# EAGLE design badge_0.0 (EAGLE 7.5.0)
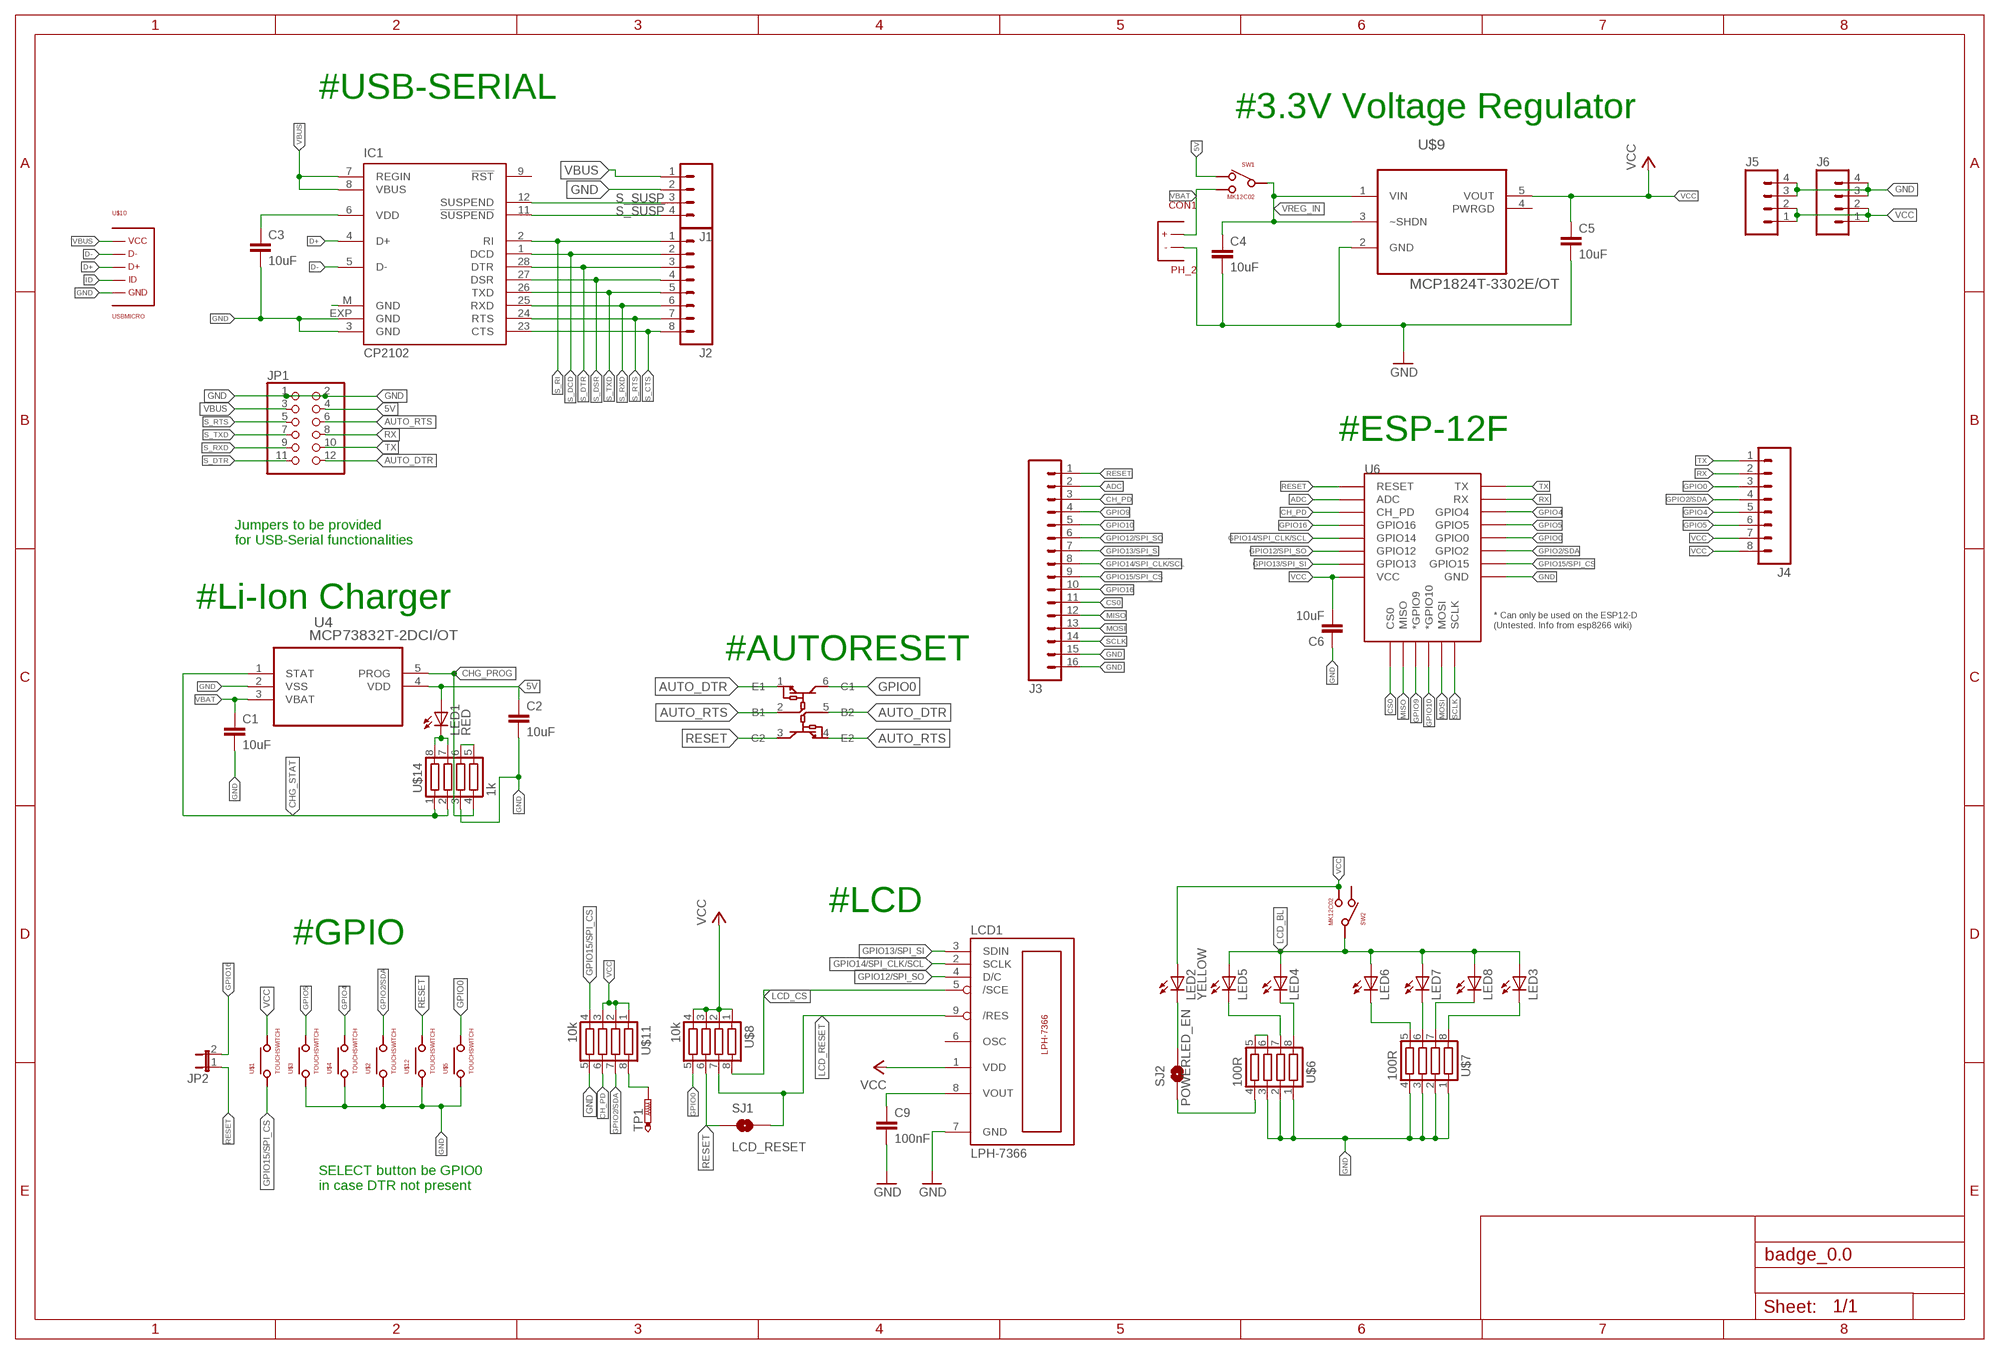
[diagram p0: schematic, sheet 1]

## Parts
C1  10uF  1UF-25V-10%(0805)"  [0805-CAP]
C2  10uF  1UF-25V-10%(0805)"  [0805-CAP]
C3  10uF  1UF-25V-10%(0805)"  [0805-CAP]
C4  10uF  1UF-25V-10%(0805)"  [0805-CAP]
C5  10uF  1UF-25V-10%(0805)"  [0805-CAP]
C6  10uF  1UF-25V-10%(0805)"  [0805-CAP]
C9  100nF  1UF-25V-10%(0805)"  [0805-CAP]
CON1  PH_2  [PH_2]
IC1  CP2102  [MLP28]
J1  M04PTH  [1X04]
J2  M08SILK_FEMALE_PTH  [1X08]
J3  M16PTH  [1X16]
J4  M08  [1X08_ROUND]
J5  M04PTH  [1X04]
J6  M04PTH  [1X04]
JP1  PINHD-2X6  [2X06]
JP2  JUMPER-2SMD-NO  [SJ_2S-NO]
LCD1  LPH-7366  [LPH-7366]
LED1  RED  LEDSML0805  [SML0805]
LED2  YELLOW  LEDSML0805  [SML0805]
LED3  LEDSML0805  [SML0805]
LED4  LEDSML0805  [SML0805]
LED5  LEDSML0805  [SML0805]
LED6  LEDSML0805  [SML0805]
LED7  LEDSML0805  [SML0805]
LED8  LEDSML0805  [SML0805]
SJ1  LCD_RESET  SOLDERJUMPERTRACE  [SJ_2S-TRACE]
SJ2  POWERLED_EN  SOLDERJUMPERTRACE  [SJ_2S-TRACE]
SW1  MK12C02  [MK12C02]
SW2  MK12C02  [MK12C02]
TP1  PTR1B1,27  [B1,27]
U4  MCP73832T-2DCI/OT  [SOT95P300X145-5N]
U6  ESP12ESMD  [ESP12E-SMD]
U$1  TOUCHSWITCH  [EVQQWN03W]
U$2  TOUCHSWITCH  [EVQQWN03W]
U$3  TOUCHSWITCH  [EVQQWN03W]
U$4  TOUCHSWITCH  [EVQQWN03W]
U$5  TOUCHSWITCH  [EVQQWN03W]
U$6  100R  RES_ARR  [YC164]
U$7  100R  RES_ARR  [YC164]
U$8  10k  RES_ARR  [YC164]
U$9  MCP1824T-3302E/OT  [SOT95P270X145-5N]
U$10  USBMICRO  [USBMICRO]
U$11  10k  RES_ARR  [YC164]
U$12  TOUCHSWITCH  [EVQQWN03W]
U$13  PEMH9,115  [SOT666]
U$14  1k  RES_ARR  [YC164]

## Nets
5V: C2.1 JP1.4 LED1.A SW1.P$2 U4.4(VDD)
ADC: J3.2 U6.ADC
AUTO_DTR: JP1.12 U$13.1(E1) U$13.5(B2)
AUTO_RTS: JP1.6 U$13.2(B1) U$13.4(E2)
CH_PD: J3.3 U6.CH_PD U$11.6
CHG_PROG: U4.5(PROG) U$14.4
CHG_STAT: U4.1(STAT) U$14.1 U$14.2
CS0: J3.11 U6.CS0
D+: IC1.4(D+) U$10.P$D+
D-: IC1.5(D-) U$10.P$D-
GND: C1.2 C2.2 C3.2 C4.2 C5.2 C6.1 C9.2 CON1.P$1 IC1.3(GND) IC1.EXP(GND) J1.2 J3.15 J3.16 J5.3 J5.4 J6.3 J6.4 JP1.1 JP1.2 LCD1.7(GND) U4.2(VSS) U6.GND U$2.P$1 U$2.P$4 U$3.P$1 U$3.P$4 U$4.P$1 U$4.P$4 U$5.P$1 U$5.P$4 U$6.1 U$6.2 U$6.3 U$7.1 U$7.2 U$7.3 U$7.4 U$9.2(GND) U$10.P$GND U$11.5 U$12.P$1 U$12.P$4 U$14.3
GPIO0: J4.3 U6.GPIO0 U$5.P$2 U$5.P$3 U$8.5 U$13.6(C1)
GPIO2/SDA: J4.4 U6.GPIO2 U$2.P$2 U$2.P$3 U$11.7
GPIO4: J4.5 U6.GPIO4 U$4.P$2 U$4.P$3
GPIO5: J4.6 U6.GPIO5 U$3.P$2 U$3.P$3
GPIO9: J3.4 U6.GPIO9(*GPIO9)
GPIO10: J3.5 U6.GPIO10(*GPIO10)
GPIO12/SPI_SO: J3.6 LCD1.4(D/C) U6.GPIO12
GPIO13/SPI_SI: J3.7 LCD1.3(SDIN) U6.GPIO13
GPIO14/SPI_CLK/SCL: J3.8 LCD1.2(SCLK) U6.GPIO14
GPIO15/SPI_CS: J3.9 U6.GPIO15 U$1.P$1 U$1.P$4 U$11.4
GPIO16: J3.10 JP2.2 U6.GPIO16
ID: U$10.P$ID
LCD_BL: LED3.A LED4.A LED5.A LED6.A LED7.A LED8.A SW2.P$1
LCD_CS: LCD1.5(/SCE) U$8.8
LCD_RESET: LCD1.9(/RES) SJ1.2 U$8.7
MISO: J3.12 U6.MISO
MOSI: J3.13 U6.MOSI
N$1: LED1.C U$14.7 U$14.8
N$2: U$14.5 U$14.6
N$3: TP1.TP U$11.8
N$5: IC1.M(GND)
N$7: LED7.C U$7.6
N$8: LED8.C U$7.7
N$9: C9.1 LCD1.8(VOUT)
N$11: U$6.5 U$6.6
N$12: LED4.C U$6.8
N$13: LED5.C U$6.7
N$14: LED3.C U$7.8
N$15: SJ2.1 U$6.4
N$16: LED2.C SJ2.2
N$20: C3.1 IC1.6(VDD)
N$22: LED6.C U$7.5
RESET: J3.1 JP2.1 SJ1.1 U6.RESET U$8.6 U$12.P$2 U$12.P$3 U$13.3(C2)
RX: J4.2 JP1.8 U6.RXD0(RX)
S_!SUSP: IC1.11(!SUSPEND) J1.4
S_CTS: IC1.23(CTS) J2.8
S_DCD: IC1.1(DCD) J2.2
S_DSR: IC1.27(DSR) J2.4
S_DTR: IC1.28(DTR) J2.3 JP1.11
S_RI: IC1.2(RI) J2.1
S_RTS: IC1.24(RTS) J2.7 JP1.5
S_RXD: IC1.25(RXD) J2.6 JP1.9
S_SUSP: IC1.12(SUSPEND) J1.3
S_TXD: IC1.26(TXD) J2.5 JP1.7
SCLK: J3.14 U6.SCLK
TX: J4.1 JP1.10 U6.TXD0(TX)
VBAT: C1.1 CON1.P$2 SW1.P$3 U4.3(VBAT)
VBUS: IC1.7(REGIN) IC1.8(VBUS) J1.1 JP1.3 U$10.P$VCC
VCC: C5.1 C6.2 J4.7 J4.8 J5.1 J5.2 J6.1 J6.2 LCD1.1(VDD) LED2.A SW2.P$3 U6.VCC U$1.P$2 U$1.P$3 U$8.1 U$8.2 U$8.3 U$8.4 U$9.5(VOUT) U$11.1 U$11.2 U$11.3
VREG_IN: C4.1 SW1.P$1 U$9.1(VIN) U$9.3(~SHDN)
Unconnected: IC1.9(!RST) LCD1.6(OSC) SW2.P$2 U$9.4(PWRGD)

## Notes on the sheet
- #USB-SERIAL
- #3.3V Voltage Regulator
- #ESP-12F
- Jumpers to be provided
  for USB-Serial functionalities
- #Li-Ion Charger
- #AUTORESET
- #LCD
- #GPIO
- SELECT button be GPIO0
  in case DTR not present

## Library data of the parts
C1-C6 C9 = SparkFun-Capacitors:1UF-25V-10%(0805): CAP-08064
CON1 = badge:PH_2
IC1 = silabs:CP210*: Single-Chip USB to UART Bridge Source: www.silabs.com .. CP2101.pdf / cp2102.pdf; MF: FARNELL; MPN: CP2102-GM; OC_FARNELL: 9282130; OC_NEWARK: 30K5635
J1 J5 J6 = SparkFun-Connectors:M04: Header 4 Standard 4-pin 0.1" header. Use with straight break away headers (SKU : PRT-00116), right angle break away headers (PRT-00553), swiss pins (PRT-00743), machine pins (PRT-00117), and female headers (PRT-00115). Molex polarized connector foot print use with SKU : PRT-08231 with associated crimp pins and housings. 1MM SMD Version SKU: PRT-10208; PROD_ID: CONN-09696
J2 = SparkFun-Connectors:M08: Header 8 Standard 8-pin 0.1" header. Use with straight break away headers (SKU : PRT-00116), right angle break away headers (PRT-00553), swiss pins (PRT-00743), machine pins (PRT-00117), and female headers (PRT-00115).; PROD_ID: CONN-08438
J3 = SparkFun-Connectors:M16: 1x16 .1" header
J4 = SparkFun-Connectors:M08: Header 8 Standard 8-pin 0.1" header. Use with straight break away headers (SKU : PRT-00116), right angle break away headers (PRT-00553), swiss pins (PRT-00743), machine pins (PRT-00117), and female headers (PRT-00115).; PROD_ID: CONN-08437
JP1 = pinhead:PINHD-2X6: PIN HEADER
JP2 = SparkFun-Retired:JUMPER-2: Jumper Basic 0.1" spaced jumper. Use with breakaway headers.
LCD1 = gm2:LPH-7366
LED1-LED8 = led:LED: LED OSRAM: - CHIPLED LG R971, LG N971, LY N971, LG Q971, LY Q971, LO R971, LY R971 LH N974, LH R974 LS Q976, LO Q976, LY Q976 LO Q996 - Hyper CHIPLED LW Q18S LB Q993, LB Q99A, LB R99A - SideLED LS A670, LO A670, LY A670, LG A670, LP A670 LB A673, LV A673, LT A673, LW A673 LH A674 LY A675 LS A676, LA A676, LO A676, LY A676, LW A676 LS A679, LY A679, LG A679 - Hyper Micro SIDELED® LS Y876, LA Y876, LO Y876, LY Y876 LT Y87S - SmartLED LW L88C, LW L88S LB L89C, LB L89S, LG L890 LS L89K, LO L89K, LY L89K LS L896, LA L896, LO L896, LY L896 - TOPLED LS T670, LO T670, LY T670, LG T670, LP T670 LSG T670, LSP T670, LSY T670, LOP T670, LYG T670 LG T671, LOG T671, LSG T671 LB T673, LV T673, LT T673, LW T673 LH T674 LS T676, LA T676, LO T676, LY T676, LB T676, LH T676, LSB T676, LW T676 LB T67C, LV T67C, LT T67C, LS T67K, LO T67K, LY T67K, LW E67C LS E67B, LA E67B, LO E67B, LY E67B, LB E67C, LV E67C, LT E67C LW T67C LS T679, LY T679, LG T679 LS T770, LO T770, LY T770, LG T770, LP T770 LB T773, LV T773, LT T773, LW T773 LH T774 LS E675, LA E675, LY E675, LS T675 LS T776, LA T776, LO T776, LY T776, LB T776 LHGB T686 LT T68C, LB T68C - Hyper Mini TOPLED® LB M676 - Mini TOPLED Santana® LG M470 LS M47K, LO M47K, LY M47K Source: http://www.osram.convergy.de LUXEON: - LUMILED® LXK2-PW12-R00, LXK2-PW12-S00, LXK2-PW14-U00, LXK2-PW14-V00 LXK2-PM12-R00, LXK2-PM12-S00, LXK2-PM14-U00 LXK2-PE12-Q00, LXK2-PE12-R00, LXK2-PE12-S00, LXK2-PE14-T00, LXK2-PE14-U00 LXK2-PB12-K00, LXK2-PB12-L00, LXK2-PB12-M00, LXK2-PB14-N00, LXK2-PB14-P00, LXK2-PB14-Q00 LXK2-PR12-L00, LXK2-PR12-M00, LXK2-PR14-Q00, LXK2-PR14-R00 LXK2-PD12-Q00, LXK2-PD12-R00, LXK2-PD12-S00 LXK2-PH12-R00, LXK2-PH12-S00 LXK2-PL12-P00, LXK2-PL12-Q00, LXK2-PL12-R00 Source: www.luxeon.com KINGBRIGHT: KA-3528ASYC Source: www.kingbright.com
SJ1 SJ2 = SparkFun-Retired:SOLDERJUMPER: Solder Jumper Standard SMD solder jumper. Used to automate production. Two varients : Normally Open and Normally Closed are the same, but have different paste layers. NC will have a large amount of paste and should jumper during reflow.
SW1 SW2 = badge:MK12C02
TP1 = testpad:PTR1: TEST PIN
U4 = Microchip_By_element14_Batch_1:MCP73832T-2DCI/OT: IC, BATT CHARGER, Li-Ion Li-Polymer, 500 mA; MPN: MCP73832T-2DCI/OT; OC_FARNELL: 1834892; OC_NEWARK: 84R5198; PACKAGE: SOT23-5; SUPPLIER: Microchip
U6 = esp8266modules:ESP12E: ESP12E Module
U$1-U$5 U$12 = badge:TOUCHSWITCH
U$6-U$8 U$11 U$14 = Simplex-rlc:RES_ARR: resistor chip array yageo YC164 series (8pin/4R)
U$9 = Microchip_By_element14_Batch_1:MCP1824T-3302E/OT: 300 mA, Low Voltage, Low Quiescent Current LDO Regulator; MPN: MCP1824T-3302E/OT; OC_FARNELL: 1578387; OC_NEWARK: 40M0704; PACKAGE: SOT23-5; SUPPLIER: Microchip
U$10 = badge:USBMICRO
U$13 = LYS_special:PEMH9,115

## Board
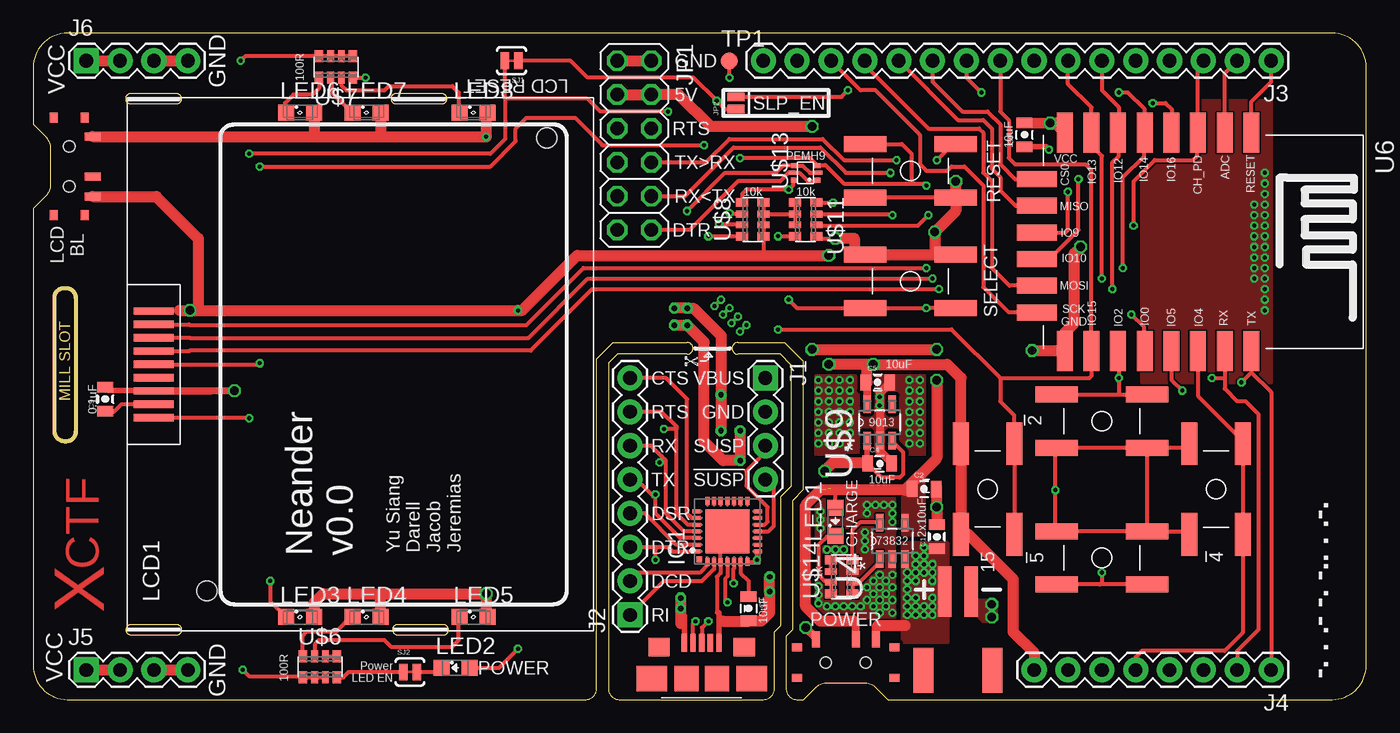
[diagram p1: board, top side]
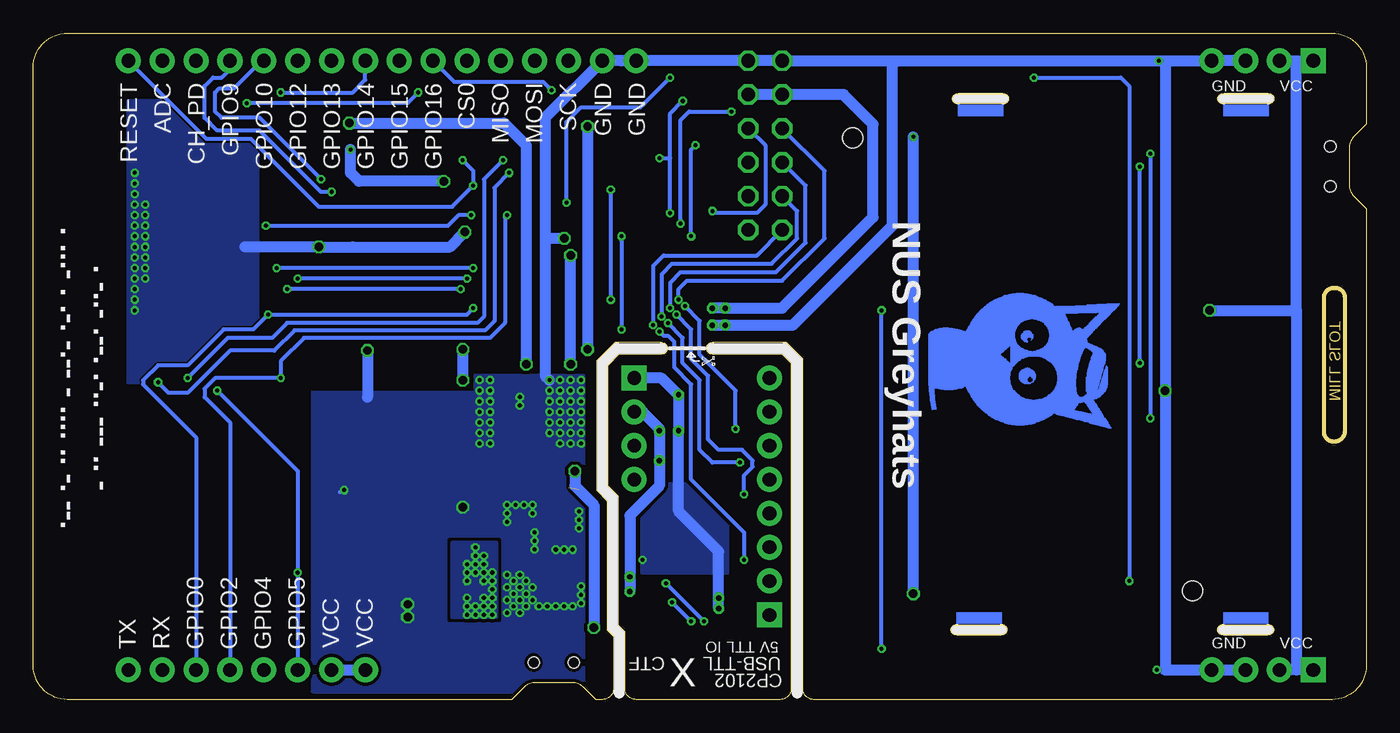
[diagram p2: board, bottom side, seen from below]

Size 100 x 50 mm. Coordinates in mm from the lower left corner, seen from the top.
Outline: 6.94,5.22 arc-90 7.33,5.62 10.75,5.62 arc-90 11.14,5.22 arc-90 10.78,4.86 7.35,4.86
Outline: 6.94,5.24 arc90 7.32,4.86 7.33,4.86
Outline: 26.94,5.22 arc-90 27.34,5.62 30.75,5.62 arc-90 31.15,5.22 arc-90 30.78,4.86 27.35,4.86
Outline: 26.94,5.24 arc90 27.32,4.86 27.34,4.86
Outline: 11.13,45.1 arc-90 10.73,44.7 7.32,44.7 arc-90 6.92,45.1 arc-90 7.29,45.47 10.72,45.47
Outline: 11.13,45.09 arc90 10.75,45.47 10.73,45.47
Outline: 31.04,45.1 arc-90 30.64,44.7 27.23,44.7 arc-90 26.83,45.1 arc-90 27.19,45.47 30.62,45.47
Outline: 31.04,45.09 arc90 30.66,45.47 30.64,45.47
Outline: 64.14,0 97.46,0 arc90 100,2.54 100,47.46 arc90 97.46,50 2.54,50 arc90 0,47.46 0,43.18 0.9,42.28 arc-45 1.27,41.38 1.27,38.63 arc-45 0.9,37.73 0,36.83 0,2.54 arc90 2.54,0 41.45,0 arc90 42.27,0.81 42.27,25.56 43.5,26.79 49.05,26.79 arc-180 49.05,25.92 43.81,25.92 43.14,25.24 43.14,0.81 arc90 43.95,0 54.79,0 arc90 55.6,0.81 55.6,5.08 56.08,5.56 56.08,15.24 56.87,16.03 56.87,25.08 56.04,25.92 52.86,25.92 arc-180 52.86,26.79 56.36,26.79 57.74,25.4 57.74,15.72 56.95,14.92 56.95,5.24 56.48,4.76 56.48,0.81 arc90 57.29,0 57.78,0 58.68,0.9 arc-45 59.58,1.27 62.34,1.27 arc-45 63.24,0.9 64.14,0
Outline: 1.59,30.16 arc-90 2.3,30.88 2.46,30.88 arc-90 3.17,30.16 3.17,20.08 arc-90 2.46,19.37 2.38,19.37 arc-90 1.59,20.16 1.59,30.16
Copper layers (1*16): Top 0.035mm / dielectric 1.5mm / Bottom 0.035mm
Design rules "dirt_cheap_dirty_boards.v1": minimum track width 5mil, minimum drill 12mil, track to track 5mil, track to pad 5mil, pad to pad 5mil, via to via 5mil, smd to smd 0mil, copper to edge 10mil, drill to drill 10mil, minimum pad ring 10mil, minimum via ring 6mil, stop-mask expansion 2mil, vias tented up to drill 25mil, thermal gap 10mil

### Footprints (pad centres in the part's own frame; a part is rotated, then mirrored left to right if it is on the bottom)
0805-CAP = smd 0.8 x 1.2: 1 -0.9,0; 2 0.9,0
PH_2 = smd 1 x 3.8: P$1 -1,0; P$2 1,0 | smd 1.5 x 3.4: P$3 -2.6,5.9; P$4 2.6,5.9
MLP28 = smd 0.6 x 0.3: 1 -2.3,1.5; 2 -2.3,1; 3 -2.3,0.5; 4 -2.3,0; 5 -2.3,-0.5; 6 -2.3,-1; 7 -2.3,-1.5; 15 2.3,-1.5; 16 2.3,-1; 17 2.3,-0.5; 18 2.3,0; 19 2.3,0.5; 20 2.3,1; 21 2.3,1.5 | smd 0.3 x 0.6: 8 -1.5,-2.3; 9 -1,-2.3; 10 -0.5,-2.3; 11 0,-2.3; 12 0.5,-2.3; 13 1,-2.3; 14 1.5,-2.3; 22 1.5,2.3; 23 1,2.3; 24 0.5,2.3; 25 0,2.3; 26 -0.5,2.3; 27 -1,2.3; 28 -1.5,2.3 | smd 3.3 x 3.3: EXP 0,0 | smd 0.435 x 0.435: M -2.103,2.103
1X04 = drill 1.016 pad 1.88 square: 1 0,0 | drill 1.016 pad 1.88: 2 2.54,0; 3 5.08,0; 4 7.62,0
1X08 = drill 1.016 pad 1.88 square: 1 0,0 | drill 1.016 pad 1.88: 2 2.54,0; 3 5.08,0; 4 7.62,0; 5 10.16,0; 6 12.7,0; 7 15.24,0; 8 17.78,0
1X16 = drill 1.016 pad 1.88: 1 0,0; 2 2.54,0; 3 5.08,0; 4 7.62,0; 5 10.16,0; 6 12.7,0; 7 15.24,0; 8 17.78,0; 9 20.32,0; 10 22.86,0; 11 25.4,0; 12 27.94,0; 13 30.48,0; 14 33.02,0; 15 35.56,0; 16 38.1,0
1X08_ROUND = drill 1.016 pad 1.88: 1 0,0; 2 2.54,0; 3 5.08,0; 4 7.62,0; 5 10.16,0; 6 12.7,0; 7 15.24,0; 8 17.78,0
2X06 = drill 1.016 octagon: 1 -6.35,-1.27; 2 -6.35,1.27; 3 -3.81,-1.27; 4 -3.81,1.27; 5 -1.27,-1.27; 6 -1.27,1.27; 7 1.27,-1.27; 8 1.27,1.27; 9 3.81,-1.27; 10 3.81,1.27; 11 6.35,-1.27; 12 6.35,1.27
SJ_2S-NO = smd 0.635 x 1.27: 1 -0.45,0; 2 0.45,0
LPH-7366 = smd 0.55 x 3: 1 4,17; 2 3,17; 3 2,17; 4 1,17; 5 0,17; 6 -1,17; 7 -2,17; 8 -3,17; 9 -4,17 | hole 1.5: -17,13; 17,-12.5
SML0805 = smd 1.2 x 1.2: A 1.05,0; C -1.05,0
SJ_2S-TRACE = smd 0.635 x 1.27: 1 -0.508,0; 2 0.508,0
MK12C02 = smd 0.6 x 1.2: P$1 -2.25,1.75; P$2 0.75,1.75; P$3 2.25,1.75 | smd 0.75 x 0.6: P$4 -3.65,1.15; P$5 -3.65,-1.15; P$6 3.65,1.15; P$7 3.65,-1.15 | hole 0.85: -1.5,0; 1.5,0
B1,27 = smd 1.27 x 1.27: TP 0,0
SOT95P300X145-5N = smd 1.321 x 0.559: 1 -1.372,0.94; 2 -1.372,0; 3 -1.372,-0.94; 4 1.372,-0.94; 5 1.372,0.94
ESP12E-SMD = smd 3 x 1.2: ADC -8.3,3.8; CH_PD -8.3,1.8; GND 8.1,-8.2; GPIO0 8.1,-2.2; GPIO2 8.1,-4.2; GPIO4 8.1,1.8; GPIO5 8.1,-0.2; GPIO12 -8.3,-4.2; GPIO13 -8.3,-6.2; GPIO14 -8.3,-2.2; GPIO15 8.1,-6.2; GPIO16 -8.3,-0.2; RESET -8.3,5.8; RXD0 8.1,3.8; TXD0 8.1,5.8; VCC -8.3,-8.2 | smd 1.2 x 3: CS0 -4.8,-10.3; GPIO9 -0.8,-10.3; GPIO10 1.2,-10.3; MISO -2.8,-10.3; MOSI 3.2,-10.3; SCLK 5.2,-10.3
EVQQWN03W = smd 1.2 x 3.2: P$1 -2,3.4; P$2 2,3.4; P$3 2,-3.4; P$4 -2,-3.4
YC164 = smd 0.65 x 0.9: 1 -1.275,-0.8; 4 1.275,-0.8; 5 1.275,0.8; 8 -1.275,0.8 | smd 0.5 x 0.9: 2 -0.4,-0.8; 3 0.4,-0.8; 6 0.4,0.8; 7 -0.4,0.8
SOT95P270X145-5N = smd 1.321 x 0.559: 1 -1.372,0.94; 2 -1.372,0; 3 -1.372,-0.94; 4 1.372,-0.94; 5 1.372,0.94
USBMICRO = smd 1.6 x 1.4: P$6 -3.2,2.35; P$7 3.2,2.35 | smd 1.8 x 1.9: P$8 -1.15,0; P$9 1.15,0 | smd 2.3 x 1.9: P$10 -3.75,0; P$11 3.75,0 | smd 0.4 x 1.35: P$D+ 0,2.675; P$D- -0.65,2.675; P$GND 1.3,2.675; P$ID 0.65,2.675; P$VCC -1.3,2.675
SOT666 = smd 0.375 x 0.5: 1 -0.537,-0.85; 3 0.538,-0.85; 4 0.538,0.849; 6 -0.538,0.85 | smd 0.3 x 0.65: 2 0,-0.923; 5 0,0.925

### Placement (x,y rotation side)
C1  67.79,12.22 90 top
C2  66.83,15.8 0 top
C3  53.66,6.83 270 top
C4  63.5,17.7 0 top
C5  63.34,23.81 0 top
C6  74.37,42.39 90 top
C9  5.4,22.54 90 top
CON1  69.37,8.1 180 top
IC1  52.07,12.62 90 top
J1  54.93,24.13 270 top
J2  44.77,6.35 90 top
J3  92.87,47.94 180 top
J4  92.87,2.22 180 top
J5  3.97,2.22 0 top
J6  3.97,47.94 0 top
JP1  45.09,41.59 270 top
JP2  52.7,44.77 90 top
LCD1  26.04,25.16 90 top
LED1  60.17,13.34 90 top
LED2  31.67,2.38 0 top
LED3  20,6.19 0 top
LED4  25,6.19 0 top
LED5  33.02,6.19 0 top
LED6  20,44.05 0 top
LED7  25,44.05 0 top
LED8  33.02,44.05 0 top
SJ1  35.88,47.94 180 top
SJ2  28.26,2.06 0 top
SW1  60.96,2.78 0 top
SW2  2.7,40.01 270 top
TP1  52.23,47.94 0 top
U4  64.45,11.91 90 top
U6  85.59,34.25 270 top
U$1  71.6,15.8 180 top
U$2  80.17,20.88 90 top
U$3  80.17,10.63 270 top
U$4  88.74,15.79 0 top
U$5  65.8,31.4 270 top
U$6  21.51,2.46 0 top
U$7  22.7,47.47 180 top
U$8  53.98,36.04 90 top
U$9  63.5,20.8 90 top
U$10  50.14,1.59 0 top
U$11  57.94,36.04 270 top
U$12  65.8,39.69 90 top
U$13  57.94,39.53 90 top
U$14  60.64,9.21 90 top

### Tracks (layer width: path | path; a pad name or v marks a point on that pad's centre or on a via)
5V  (via drill 0.64)  (1 unrouted)
  Top 0.305: 59.85,15.88 60.17,15.56 LED1.A
  Top 0.61: SW1.P$2 61.71,5.76 61.59,5.87
  Top 0.813: v58.42,43.02 50.8,43.02 48.42,45.4 JP1.4 | v58.42,26.27 v67.79,26.27 | v67.79,23.97 67.79,18.1 65.41,15.72 59.05,15.72 57.94,14.61 57.94,6.99 59.05,5.87 61.59,5.87
  Bottom 0.813: v58.42,43.02 v58.42,26.27 | v67.79,26.27 v67.79,23.97
  pour Top (isolate 0.254, no thermals): 65.25,15.56 65.25,12.38 66.83,12.38 66.83,17.14
ADC
  Top 0.305: U6.ADC 89.39,47 J3.2
AUTO_DTR
  Top 0.305: U$13.1 58.7,38.89 58.1,38.89 57.47,39.53 U$13.5 56.67,39.53 56.04,38.89 52.86,38.89 49.21,35.24 JP1.12
AUTO_RTS  (via drill 0.3)
  Top 0.305: U$13.2 58.26,39.53 57.72,40.07 U$13.4 56.26,40.07 55.72,39.53 51.91,39.53 v49.05,36.67
  Bottom 0.305: JP1.6 45.09,41.59 45.09,37.15 45.72,36.51 48.9,36.51 v49.05,36.67
CH_PD  (via drill 0.3, 0.3 pad 0.3)
  Top 0.305: U$11.6 58.82,35.56 66.36,35.56 v67.15,36.35 | J3.3 87.39,47.54 U6.CH_PD 87.31,42.48 87.31,40.8 87,40.48 84.14,40.48 82.55,38.89 v82.55,35.56
  Bottom 0.305: v82.55,35.56 68.9,35.56 68.1,36.35 v67.15,36.35
CHG_PROG
  Top 0.305: U4.5 62.01,13.28 61.44,12.7 U$14.4
CHG_STAT
  Top 0.305: 63.5,10.79 63.51,10.78 U4.1 63.51,10.33 61.99,8.81 U$14.2 U$14.1
CS0
  Top 0.305: 75.29,39.33 U6.CS0 73.66,39.05 72.55,40.16 72.55,43.18 71.6,44.13 69.69,44.13 67.47,46.35 J3.11
D+  (via drill 0.3)
  Top 0.305: IC1.4 52.07,9.21 51.91,9.05 51.91,7.46 v52.07,7.3 | v50.64,5.87 50.16,5.4 50.16,4.29 U$10.P$D+
  Bottom 0.305: v52.07,7.3 v50.64,5.87
D-  (via drill 0.3)
  Top 0.305: U$10.P$D- 49.49,5.67 v49.69,5.87 | v52.55,8.73 52.55,9.84 52.57,9.87 IC1.5
  Bottom 0.305: v49.69,5.87 v52.55,8.73
GND  (via drill 0.3, 0.3 pad 0.41, 0.41 pad 0.81, 0.64)
  Top 0.305: U$7.1 U$7.2 U$7.3 U$7.4 15.88,48.27 v15.56,47.94 | C9.2 5.4,23.34 5.56,23.18 | 9.02,23.18 LCD1.7 | U$6.3 U$6.2 U$6.1 20.15,1.75 16.19,1.75 v15.72,2.22 | IC1.EXP 51.57,12.12 IC1.3 51.57,9.5 51.28,9.21 51.28,6.51 51.44,6.51 | 51.44,5.24 | U$3.P$1 U$2.P$4 | U$3.P$1 U$3.P$4 76.68,12.54 v76.68,15.72 76.68,18.86 76.69,18.88 76.68,18.89 76.52,18.89 | U$4.P$1 86.43,18.88 U$2.P$4 | U$3.P$1 86.5,12.63 U$4.P$4 | U$5.P$4 62.4,33.8 | U$2.P$4 U$2.P$1 | U$12.P$4 U$12.P$1 62.4,37.93 | U$5.P$1 69.11,33.5 67.63,33.5 | U$11.5 58.9,34.76 59.05,34.61 v60.17,34.61 | 61.44,34.77 61.59,34.61
  Top 0.406: U$10.P$GND 51.44,5.24 51.44,5.56 | 51.44,5.24 51.44,5.87 | 51.44,5.87 51.44,6.51 | 51.44,5.87 51.75,5.87 | 69.22,37.7 U$12.P$4 | C6.1 75.96,41.51 v76.2,41.27 | 9.02,23.18 5.66,23.18 C9.2
  Top 0.546: LCD1.7 13.32,23.16 v15.08,23.18
  Top 0.61: C5.2 64.22,23.73 63.5,23.02 v63.5,22.7 v63.5,22.07 U$9.2 63.5,18.65 64.4,17.75 C4.2
  Top 0.813: C2.2 67.79,15.95 v67.79,14.45 C1.2 | JP1.1 JP1.2 | v74.93,26.19 77.34,26.19 U6.GND 77.39,27.54 78.11,28.26 78.11,33.5 v78.58,33.97 | 67.63,33.5 v67.63,35.08 69.2,36.66 U$12.P$4 | U$5.P$4 U$5.P$1 | 61.59,33.5 61.59,34.61 v60.17,34.61 | 51.75,5.87 53.74,5.87 C3.2 53.89,5.87 54.61,5.87 55.24,6.51 v55.24,8.1 v55.24,9.21 | J5.3 J5.4 | J6.3 J6.4 | v53.02,20.16 v53.02,17.94 51.75,17.94 50.32,19.37 50.32,26.83 v49.05,28.1 v48.1,28.1 | CON1.P$1 70.37,6.71 70.33,7.14 | 69.22,37.7 v69.22,38.89
  Bottom 0.305: 55.56,47.62 55.88,47.94 | 55.56,47.78 55.4,47.94 | 15.08,2.22 v15.72,2.22 | v76.68,15.72 76.83,15.72 76.99,15.56
  Bottom 0.406: 76.2,34.13 76.04,33.97
  Bottom 0.813: 61.59,34.45 61.59,43.66 J3.15 55.88,47.94 55.4,47.94 J3.16 JP1.2 JP1.1 35.24,47.94 | 61.59,34.45 61.59,24.29 v61.28,23.97 | v67.63,35.08 68.74,33.97 76.04,33.97 v78.58,33.97 84.14,33.97 | J6.3 J6.4 15.08,47.94 | 35.24,47.94 v15.56,47.94 15.08,47.94 | 15.08,47.94 v15.08,23.18 15.08,2.22 J5.4 J5.3 | J1.2 54.29,21.59 53.02,20.32 v53.02,20.16 v53.02,17.94 53.02,16.03 55.24,13.81 v55.24,9.21 v55.24,8.1 | v49.05,28.1 v48.1,28.1 43.02,28.1 35.56,35.56 35.56,47.62 35.24,47.94 | v60.17,34.61 61.44,34.61 61.59,34.45 | v74.93,26.19 74.93,22.7 | v69.22,38.89 75.56,38.89 76.2,39.53 v76.2,41.27
  other vias: 59.69,23.97 60.48,23.97 59.69,23.18 60.48,23.18 61.28,23.18 61.28,22.38 60.48,22.38 59.69,22.38 59.69,21.59 60.48,21.59 61.28,21.59 61.28,20.8 60.48,20.8 59.69,20.8 59.69,20 60.48,20 61.28,20 60.48,19.21 59.69,19.21 65.72,23.97 65.72,23.18 65.72,22.38 65.72,21.59 65.72,20.8 65.72,20 65.72,19.21 64.45,13.34 71.91,7.14 64.45,13.97 64.45,14.61 63.82,14.61 63.18,14.61 62.55,13.97 62.55,14.61 59.05,14.13 59.05,13.49 59.05,12.86 62.39,12.54 62.39,11.91 62.39,11.27 59.53,11.25 60.8,11.25 60.17,11.25 64.45,9.37 63.5,9.37 64.45,8.41 63.98,8.89 63.5,8.41 63.02,8.89 62.55,8.41 63.02,7.94 63.98,7.94 64.45,7.46 63.5,7.46 63.98,6.99 64.45,6.51 62.55,7.46 63.02,6.99 63.5,6.51 62.07,6.99 60.8,6.99 60.17,6.99 59.53,6.99 58.9,7.22 58.9,8.49 61.44,6.99 58.9,7.86 58.9,23.97 58.9,23.18 58.9,22.38 58.9,21.59 58.9,20.8 58.9,20 58.9,19.21 66.52,19.21 66.52,20 66.52,20.8 66.52,21.59 66.52,22.38 66.52,23.18 66.52,23.97 71.91,6.19 92.39,39.53 92.39,38.73 92.39,37.94 91.6,37.15 92.39,37.15 91.6,36.35 92.39,36.35 91.6,35.56 92.39,35.56 91.6,34.77 92.39,34.77 91.6,33.97 92.39,33.97 91.6,33.18 92.39,33.18 91.6,32.38 92.39,32.38 91.6,31.59 92.39,31.59 92.39,30.8 92.39,30 92.39,29.21
  pour Top (isolate 0.254, no thermals): 58.74,18.41 58.74,24.29 66.83,24.29 66.83,18.41
  pour Bottom (isolate 0.254, rank 3, no thermals): 58.74,24.29 66.83,24.29 66.83,23.02 79.06,23.02 79.06,0.64 58.74,0.64
  pour Top (isolate 0.127, no thermals): 58.74,15.08 58.74,6.19 64.61,6.19 64.61,15.08
  pour Top (no thermals): 70.33,7.46 72.07,7.46 72.23,7.3 72.23,6.03 72.07,5.87 71.28,5.87 70.33,6.83
  pour Top: 92.87,44.93 92.87,23.81 83.19,23.81 83.19,44.93
  pour Bottom: 92.87,44.93 92.87,23.81 83.19,23.81 83.19,44.93
GPIO0  (via drill 0.3, 0.3 pad 0.3)
  Top 0.305: U6.GPIO0 83.34,26.19 83.34,27.94 v82.39,28.89 | v56.67,30 57.31,29.37 62.37,29.37 U$5.P$3 66.96,29.4 v66.99,29.37 67.02,29.4 U$5.P$2 | U$13.6 56.99,38.89 56.99,38.58 v56.67,38.26 53.5,38.26 53.18,37.94 U$8.5
  Bottom 0.305: v56.67,30 v56.67,38.26 | J4.3 87.79,19.68 91.76,23.65 91.76,23.97 90.65,25.08 88.42,25.08 85.72,27.78 83.5,27.78 v82.39,28.89 67.47,28.89 v66.99,29.37
GPIO2/SDA  (via drill 0.3 pad 0.3)
  Top 0.305: U6.GPIO2 81.44,26.04 v81.44,24.13 81.44,22.88 | U$11.7 64.37,36.44 v64.45,36.35 | 76.75,22.86 U$2.P$2 81.44,22.88 | 81.44,22.88 U$2.P$3 83.01,22.88
  Bottom 0.305: v64.45,36.35 64.61,36.2 64.61,28.26 65.72,27.15 79.69,27.15 81.44,25.4 v81.44,24.13 86.36,24.13 87.15,23.34 87.15,22.7 85.25,20.8 J4.4
GPIO4
  Top 0.305: U6.GPIO4 87.39,22.79 90.49,19.68 90.49,19.44 U$4.P$2 U$4.P$3 90.74,5.02 89.38,3.65 83.19,3.65 82.71,3.17 J4.5
GPIO5  (via drill 0.3)
  Top 0.305: U6.GPIO5 85.39,23.99 v86.2,23.18 | U$3.P$2 80.01,8.63 | 80.01,8.63 U$3.P$3 | v80.17,9.53 80.17,8.79 80.01,8.63
  Bottom 0.305: v86.2,23.18 80.17,17.14 v80.17,9.53 J4.6
GPIO9  (via drill 0.3)
  Top 0.305: U6.GPIO9 77.44,35.05 77.63,35.24 v77.63,38.1
  Bottom 0.305: v77.63,38.1 78.42,38.1 83.03,42.7 86.2,42.7 87.15,43.66 87.15,46.04 86.52,46.67 85.88,46.67 85.25,47.31 J3.4
GPIO10  (via drill 0.3)
  Top 0.305: U6.GPIO10 76.23,33.05 78.42,35.24 v78.42,39.05
  Bottom 0.305: J3.5 82.87,47.94 84.93,45.88 86.04,45.88 86.36,45.56 86.36,44.13 85.88,43.66 83.03,43.66 v78.42,39.05
GPIO12/SPI_SO  (via drill 0.3 pad 0.3)
  Top 0.305: LCD1.4 11.71,26.16 11.75,26.19 37.31,26.19 41.91,30.8 v67.94,30.8 | J3.6 80.17,45.72 81.44,44.45 81.44,42.6 | 81.44,42.6 U6.GPIO12 | v80.96,30.8 80.96,40.32 81.44,40.8 81.44,42.6
  Bottom 0.305: v67.94,30.8 v80.96,30.8
GPIO13/SPI_SI  (via drill 0.3 pad 0.3)
  Top 0.305: LCD1.3 11.73,27.16 11.75,27.15 37.15,27.15 41.59,31.59 v67.47,31.59 | J3.7 77.63,46.2 79.39,44.44 U6.GPIO13 79.38,42.54 79.38,41.59 80.17,40.8 v80.17,31.59
  Bottom 0.305: v67.47,31.59 v80.17,31.59
GPIO14/SPI_CLK/SCL  (via drill 0.3, 0.3 pad 0.3)
  Top 0.305: LCD1.2 11.69,28.16 11.75,28.1 36.99,28.1 41.27,32.38 v66.99,32.38 | v81.44,45.56 82.11,45.56 83.39,44.29 U6.GPIO14 83.34,42.51 83.34,40.8 81.76,39.21 v81.76,32.38
  Bottom 0.305: v81.44,45.56 76.04,45.56 75.09,46.51 J3.8 | v66.99,32.38 v81.76,32.38
GPIO15/SPI_CS  (via drill 0.3)
  Top 0.305: 72.55,24.13 79.22,24.13 79.39,24.3 U6.GPIO15 79.38,26.14 79.38,39.72 78.93,40.16 73.66,40.16 73.18,40.64 73.18,43.5 72.55,44.13 J3.9 | U$1.P$1 U$1.P$4 73.6,21.34 72.55,22.38 72.55,24.13 | U$11.4 v55.88,34.76 v55.88,34.77 | v55.88,27.78 68.9,27.78 72.55,24.13
  Bottom 0.305: v55.88,34.77 v55.88,27.78
GPIO16  (via drill 0.3)
  Top 0.305: v83.98,44.77 84.93,44.77 85.41,44.29 85.41,42.57 U6.GPIO16 | v61.12,45.72 60.64,45.24 53.18,45.24 53.16,45.22 JP2.2 | J3.10 70.01,46.67 v71.12,45.56
  Bottom 0.305: J3.10 68.42,46.35 61.75,46.35 v61.12,45.72 | v71.12,45.56 71.91,44.77 v83.98,44.77
LCD_BL  (via drill 0.3, 0.64)
  Top 0.305: 33.97,43.81 LED8.A | 26.05,7.88 26.11,7.94 | 33.95,42.26 v33.97,42.23 34.05,42.15 | 26.05,42.27 26.04,42.26 | 21.05,42.35 20.95,42.26
  Top 0.813: LED4.A 26.05,7.88 | SW2.P$1 20.95,42.26 26.04,42.26 33.95,42.26 | 33.97,43.81 v33.97,42.23 | LED7.A 26.05,42.27 | LED6.A 21.05,42.35 | LED5.A 33.97,6.29 v33.97,7.94 26.11,7.94 21.75,7.94 21.05,7.24 LED3.A
  Bottom 0.813: v33.97,7.94 v33.97,42.23
LCD_CS  (via drill 0.3)
  Top 0.305: LCD1.5 16.9,25.16 v16.99,25.24 | v16.99,40.01 34.29,40.01 36.2,41.91 36.2,42.86 36.99,43.66 40.64,43.66 42.7,41.59 v50.32,41.59 | U$8.8 v50.65,34.76 v50.64,34.77
  Bottom 0.305: v16.99,25.24 v16.99,40.01 | v50.64,34.77 50.64,41.27 v50.32,41.59
LCD_RESET  (via drill 0.3)
  Top 0.305: 35.4,45.09 41.59,45.09 42.55,44.13 v47.62,44.13 | 35.4,45.09 35.4,48.07 SJ1.2 | 35.4,45.09 35.4,42.07 34.29,40.96 v16.19,40.96 | v16.19,21.11 9.08,21.11 LCD1.9 | U$8.7 51.52,35.64 v51.44,35.72
  Bottom 0.305: v16.19,40.96 v16.19,21.11 | v51.44,35.72 51.44,43.5 50.8,44.13 v47.62,44.13
MISO
  Top 0.305: U6.MISO 73.69,37.05 72.55,38.19 72.55,39.21 71.91,39.85 71.91,42.86 71.28,43.5 69.37,43.5 J3.12
MOSI
  Top 0.305: J3.13 62.39,47.62 67.15,42.86 70.96,42.86 71.28,42.55 71.28,39.53 71.91,38.89 71.91,32.38 73.25,31.05 U6.MOSI
N$1
  Top 0.305: LED1.C 60.17,12.22 59.53,12.22 58.9,11.59 58.9,9.37 59.37,8.89 59.84,8.89 | 59.84,8.89 U$14.8 | 59.84,8.89 U$14.7
N$2
  Top 0.305: U$14.6 U$14.5
N$3  (via drill 0.3)
  Top 0.305: U$11.8 v60,37.31 v60.01,37.31 | v52.23,46.67 TP1.TP
  Bottom 0.305: v60.01,37.31 60.01,43.34 58.9,44.45 54.45,44.45 v52.23,46.67
N$7
  Top 0.305: U$7.6 22.3,46.6 22.38,46.51 22.38,45.56 23.5,44.45 23.56,44.45 LED7.C
N$8
  Top 0.305: U$7.7 23.1,46.11 23.5,45.72 26.35,45.72 26.67,46.04 31.43,46.04 31.91,45.56 31.91,44.11 LED8.C
N$9
  Top 0.305: LCD1.8 6.6,22.16 6.03,21.59 5.47,21.59 C9.1
N$11
  Top 0.305: U$6.6 U$6.5
N$12
  Top 0.305: LED4.C 23.81,6.19 22.7,5.08 20.48,5.08 20.16,4.76 20.16,3.18 U$6.8
N$13
  Top 0.305: U$6.7 21.11,4.13 21.43,4.45 26.35,4.45 26.83,3.97 31.43,3.97 31.91,4.45 31.91,6.13 LED5.C
N$14  (via drill 0.3)
  Top 0.305: U$7.8 v24.92,46.67 | v17.78,8.89 17.78,7.36 LED3.C
  Bottom 0.305: v24.92,46.67 18.41,46.67 17.78,46.04 v17.78,8.89
N$15
  Top 0.305: U$6.4 23.25,1.66 23.65,2.06 SJ2.1
N$16
  Top 0.305: SJ2.2 30.3,2.06 LED2.C
N$20
  Top 0.305: IC1.6 53.07,9.48 53.66,8.89 C3.1
N$22
  Top 0.305: 18.73,44.28 LED6.C 18.89,44.11 18.89,44.77 19.53,45.4 20.95,45.4 21.43,45.88 21.43,46.51 21.43,46.52 U$7.5
RESET  (via drill 0.3, 0.3 pad 0.3)
  Top 0.305: U$8.6 52.3,36.44 v52.23,36.51 | SJ1.1 40.32,47.94 41.59,46.67 49.53,46.67 v51.28,44.93 51.91,44.29 52.68,44.29 JP2.1 | U$13.3 58.79,40.11 | 58.79,40.11 58.26,40.64 v53.02,40.64 | U6.RESET 91.39,44.87 92.87,46.35 J3.1 | 58.79,40.11 59.43,40.11 60.8,38.73 66.04,38.73 | 66.04,38.73 66.83,38.73 v66.99,38.58 | U$12.P$3 68.99,41.69 v67.79,40.48 | U$12.P$2 65.15,41.69 65.88,40.96 65.88,38.89 66.04,38.73
  Bottom 0.305: v52.23,36.51 52.23,40.64 | 52.23,40.64 52.23,43.97 v51.28,44.93 | v53.02,40.64 52.23,40.64 | J3.1 87,42.07 83.66,42.07 78.58,36.99 68.58,36.99 v66.99,38.58 66.99,39.69 v67.79,40.48
RX  (via drill 0.3 pad 0.3)
  Top 0.305: JP1.8 50.48,40.32 52.23,42.07 59.21,42.07 60.8,40.48 v64.77,40.48 | U6.RXD0 89.39,24.13 | 89.39,24.13 89.39,23.33 90.33,22.38 90.96,22.38 91.92,21.43 91.92,5.24 90.33,3.65 J4.2 | v88.42,24.13 89.39,24.13
  Bottom 0.305: v64.77,40.48 66.2,39.05 66.2,28.73 66.67,28.26 80.96,28.26 82.07,27.15 85.41,27.15 v88.42,24.13
S_!SUSP
  Top 0.305: IC1.11 55.17,12.62 55.56,13.02 55.56,15.88 J1.4
S_CTS
  Top 0.305: J2.8 47.47,24.13 49.05,22.54 49.05,13.97 49.4,13.62 IC1.23
S_DCD
  Top 0.305: IC1.1 50.57,10.09 50.01,9.53 45.4,9.53 J2.2
S_DSR
  Top 0.305: IC1.27 48.23,11.62 45.88,13.97 J2.4
S_DTR  (via drill 0.3)
  Top 0.305: 46.83,11.43 47.62,11.43 47.94,11.11 IC1.28 | 46.83,11.43 J2.3 | v53.02,27.62 v53.5,28.1 | v46.67,10.48 46.67,11.27 46.83,11.43
  Bottom 0.305: JP1.11 45.72,33.34 52.7,33.34 53.5,32.54 v53.5,28.1 | v53.02,27.62 52.7,27.3 52.39,27.3 51.91,26.83 51.91,24.92 50.64,23.65 50.64,16.51 46.67,12.54 v46.67,10.48
S_RI
  Top 0.305: IC1.2 51.07,9.79 50.16,8.89 47.31,8.89 J2.1
S_RTS  (via drill 0.3)
  Top 0.305: 48.26,20.32 48.26,13.97 49.11,13.12 IC1.24 | 48.26,20.32 48.26,20.48 47.15,21.59 J2.7 | 48.26,20.32 v47.31,20.32 | v51.12,29.53 v51.59,30
  Bottom 0.305: v47.31,20.32 47.31,23.18 50.01,25.88 50.01,28.42 v51.12,29.53 | JP1.5 40.64,39.69 40.64,34.61 43.81,31.43 50.96,31.43 51.59,30.8 v51.59,30
S_RXD  (via drill 0.3)
  Top 0.305: 47.15,18.26 47.47,17.94 47.47,13.97 48.82,12.62 IC1.25 | 47.15,18.26 46.35,19.05 J2.6 | 47.15,18.26 47.15,17.94 v46.99,17.78 | v52.39,28.26 v52.86,28.73
  Bottom 0.305: v46.99,17.78 49.05,17.78 50.01,18.73 50.01,23.97 51.28,25.24 51.28,27.15 v52.39,28.26 | JP1.9 42.7,36.67 42.7,34.61 44.61,32.7 52.07,32.7 52.86,31.91 v52.86,28.73
S_SUSP
  Top 0.305: J1.3 54.93,18.57 53.5,17.14 53.5,16.03 55.09,14.45 55.09,13.34 54.87,13.12 IC1.12
S_TXD  (via drill 0.3)
  Top 0.305: J2.5 45.24,16.51 46.51,15.24 46.67,15.24 v46.67,15.4 46.67,13.97 48.52,12.12 IC1.26 | v51.75,28.89 v52.23,29.37
  Bottom 0.305: v46.67,15.4 46.67,16.83 46.04,17.46 46.04,17.94 46.83,18.73 48.58,18.73 49.37,19.53 49.37,24.29 50.64,25.56 50.64,27.78 v51.75,28.89 | JP1.7 42.07,38.58 42.07,34.29 44.29,32.07 51.44,32.07 52.23,31.27 v52.23,29.37
SCLK
  Top 0.305: U6.SCLK 73.19,29.05 71.28,30.96 71.28,38.58 69.85,40.01 68.9,40.01 68.58,39.69 66.99,39.69 66.52,40.16 66.52,42.39 63.18,45.72 62.07,45.72 J3.14
TX  (via drill 0.3 pad 0.3)
  Top 0.305: JP1.10 48.9,37.78 52.55,41.43 59.05,41.43 60.96,39.53 v64.29,39.53 | 91.39,25.93 U6.TXD0 91.39,24.55 | v90.65,23.81 91.39,24.55 | 91.39,24.55 92.87,23.07 J4.1
  Bottom 0.305: v64.29,39.53 65.41,38.42 65.41,28.42 66.12,27.7 80.41,27.7 81.92,26.19 85.25,26.19 88.42,23.02 89.85,23.02 v90.65,23.81
VBAT  (via drill 0.3)
  Top 0.61: SW1.P$3 63.21,5.42 63.34,5.56
  Top 0.813: 63.34,5.56 65.41,5.56
  other vias: 66.83,10.79 66.2,10.79 66.83,10.16 66.2,10.16 66.83,11.43 66.83,9.53 66.2,9.53 66.2,8.89 65.56,9.53 65.56,8.89 67.47,9.53 67.47,10.16 65.56,8.26 65.56,7.62 65.56,6.99 65.56,6.35 66.2,7.62 67.47,8.89 67.47,7.62 67.47,6.99 66.83,6.99 66.2,6.99 66.2,6.35 66.83,6.35 67.47,6.35
  pour Top (isolate 0.254, no thermals): 65.25,4.29 65.25,11.75 68.58,11.75 68.58,4.29
  pour Bottom (rank 2, no thermals): 65.25,11.75 68.58,11.75 68.58,6.19 65.25,6.19
VBUS  (via drill 0.3, 0.41 pad 0.81)
  Top 0.305: IC1.7 54.14,10.32 v54.29,10.48 54.29,11.11 54.3,11.12 IC1.8
  Top 0.406: U$10.P$VCC 48.84,5.71 | 48.84,5.71 48.84,6.29 | 48.84,5.71 48.58,5.71
  Top 0.813: 48.58,5.71 v48.58,6.83 v48.58,7.62 | v48.1,29.37 v49.05,29.37 49.53,29.37 51.59,27.3 v51.59,20.16 | JP1.3 46.35,45.4
  Bottom 0.813: v48.58,6.83 48.58,11.11 51.59,14.13 v51.59,20.16 v51.59,22.86 52.86,24.13 J1.1 | v49.05,29.37 v48.1,29.37 43.81,29.37 36.99,36.2 36.99,43.18 39.21,45.4 JP1.3 46.35,45.4
  pour Bottom (isolate 0.254, no thermals): 50.96,16.19 47.94,13.18 47.94,9.53 54.29,9.53 54.29,16.19
VCC  (via drill 0.3, 0.64)
  Top 0.305: LCD1.1 9.04,29.2 9.05,29.21 10.95,29.21 | 36.51,29.37 v36.35,29.21 | U$11.1 U$11.2 | U$11.2 U$11.3 | LED2.A 34.92,2.38 v36.35,3.81 | U$8.3 U$11.2 | U$8.3 U$8.2 U$8.1 54.77,33.34 | U$8.4 U$8.3
  Top 0.61: C5.1 62.55,23.81 62.55,22.18 U$9.5
  Top 0.813: 10.95,29.21 v11.75,29.21 12.38,29.21 | 12.38,29.21 v36.35,29.21 36.67,29.21 40.8,33.34 54.77,33.34 v59.69,33.34 | SW2.P$3 9.23,37.76 12.38,34.61 12.38,29.21 | 62.55,23.81 62.55,25 | 62.55,25 62.71,25.16 v63.02,25.16 68.58,25.16 69.6,24.15 U$1.P$3 U$1.P$2 70.15,12.4 73.5,9.05 73.5,5.08 75.09,3.49 J4.8 | 62.55,25 62.55,25.16 v59.69,25.16 | J5.1 J5.2 | J6.1 J6.2 | C6.2 v76.28,43.26 | v76.28,43.26 | v76.28,43.26 76.67,43.26 U6.VCC
  Bottom 0.305: v36.35,3.81 v36.35,29.21
  Bottom 0.813: v59.69,25.16 v59.69,33.34 | J4.7 J4.8 | v63.02,25.16 63.02,41.59 64.69,43.26 v76.28,43.26 | J6.2 5.24,47.94 | 5.24,47.94 J6.1 | J5.1 5.24,2.22 | 5.24,2.22 J5.2 | v11.75,29.21 5.24,29.21 | 5.24,29.21 5.24,47.94 | 5.24,29.21 5.24,2.22
VREG_IN  (via drill 0.64)
  Top 0.305: U$9.3 64.44,19.38 65.25,18.57 65.25,16.91 65.01,16.67 63.63,16.67 C4.1
  Top 0.406: U$9.1 62.56,17.74 C4.1
  Top 0.61: SW1.P$1 58.71,4.63 v57.94,5.4
  Top 0.813: v59.37,17.14 60.01,17.78 62.52,17.78 C4.1
  Bottom 0.813: v59.37,17.14 59.37,16.03 57.94,14.61 v57.94,5.4
(copper drawn outside any net)
  shapes: Bottom area x836

### Text on the board
Top: CTF | X
Dimension: MILL SLOT
tPlace: GND | GND | VCC | 100R | LCD RESET | 5V | SLP_EN | RTS | 10uF | PEMH9 | VCC | TX>RX | IO13 | IO12 | IO14 | IO16 | ADC | CS0 | CH_PD | RESET | RX<TX | 10k | 10k | RESET | MISO | DTR | IO9 | LCD / BL | IO10 | MOSI | SELECT | SCK | IO15 | IO2 | IO0 | IO5 | IO4 | RX | TX | GND | 10uF | CTS | VBUS | RTS | GND | 0.1uF | 9013 | !2 | RX | SUSP | TX | !SUSP | 10uF | DSR | CHARGE | 2x10uF | 73832 | Neander / v0.0 | Yu Siang / Darell / Jacob / Jeremias | DTR | !5 | 1k | 15 | !4 | DCD | RI | 10uF | POWER | VCC | GND | 100R | Power / LED EN | POWER | -. . .- -. -.. . .-.
bPlace: VCC | GND | GND | GND | SCK | MOSI | MISO | CS0 | GPIO16 | GPIO15 | GPIO14 | GPIO13 | GPIO12 | GPIO10 | GPIO9 | CH_PD | ADC | RESET | NUS Greyhats | . -..- .--. .-.. --- .. - / . ...- . .-. -.-- - .... .. -. --. | VCC | GND | 5V TTL IO | VCC | VCC | GPIO5 | GPIO4 | GPIO2 | GPIO0 | RX | TX | USB-TTL | CTF | X | CP2102
tStop: CTF | X